# EAGLE design working (EAGLE 6.5.0)
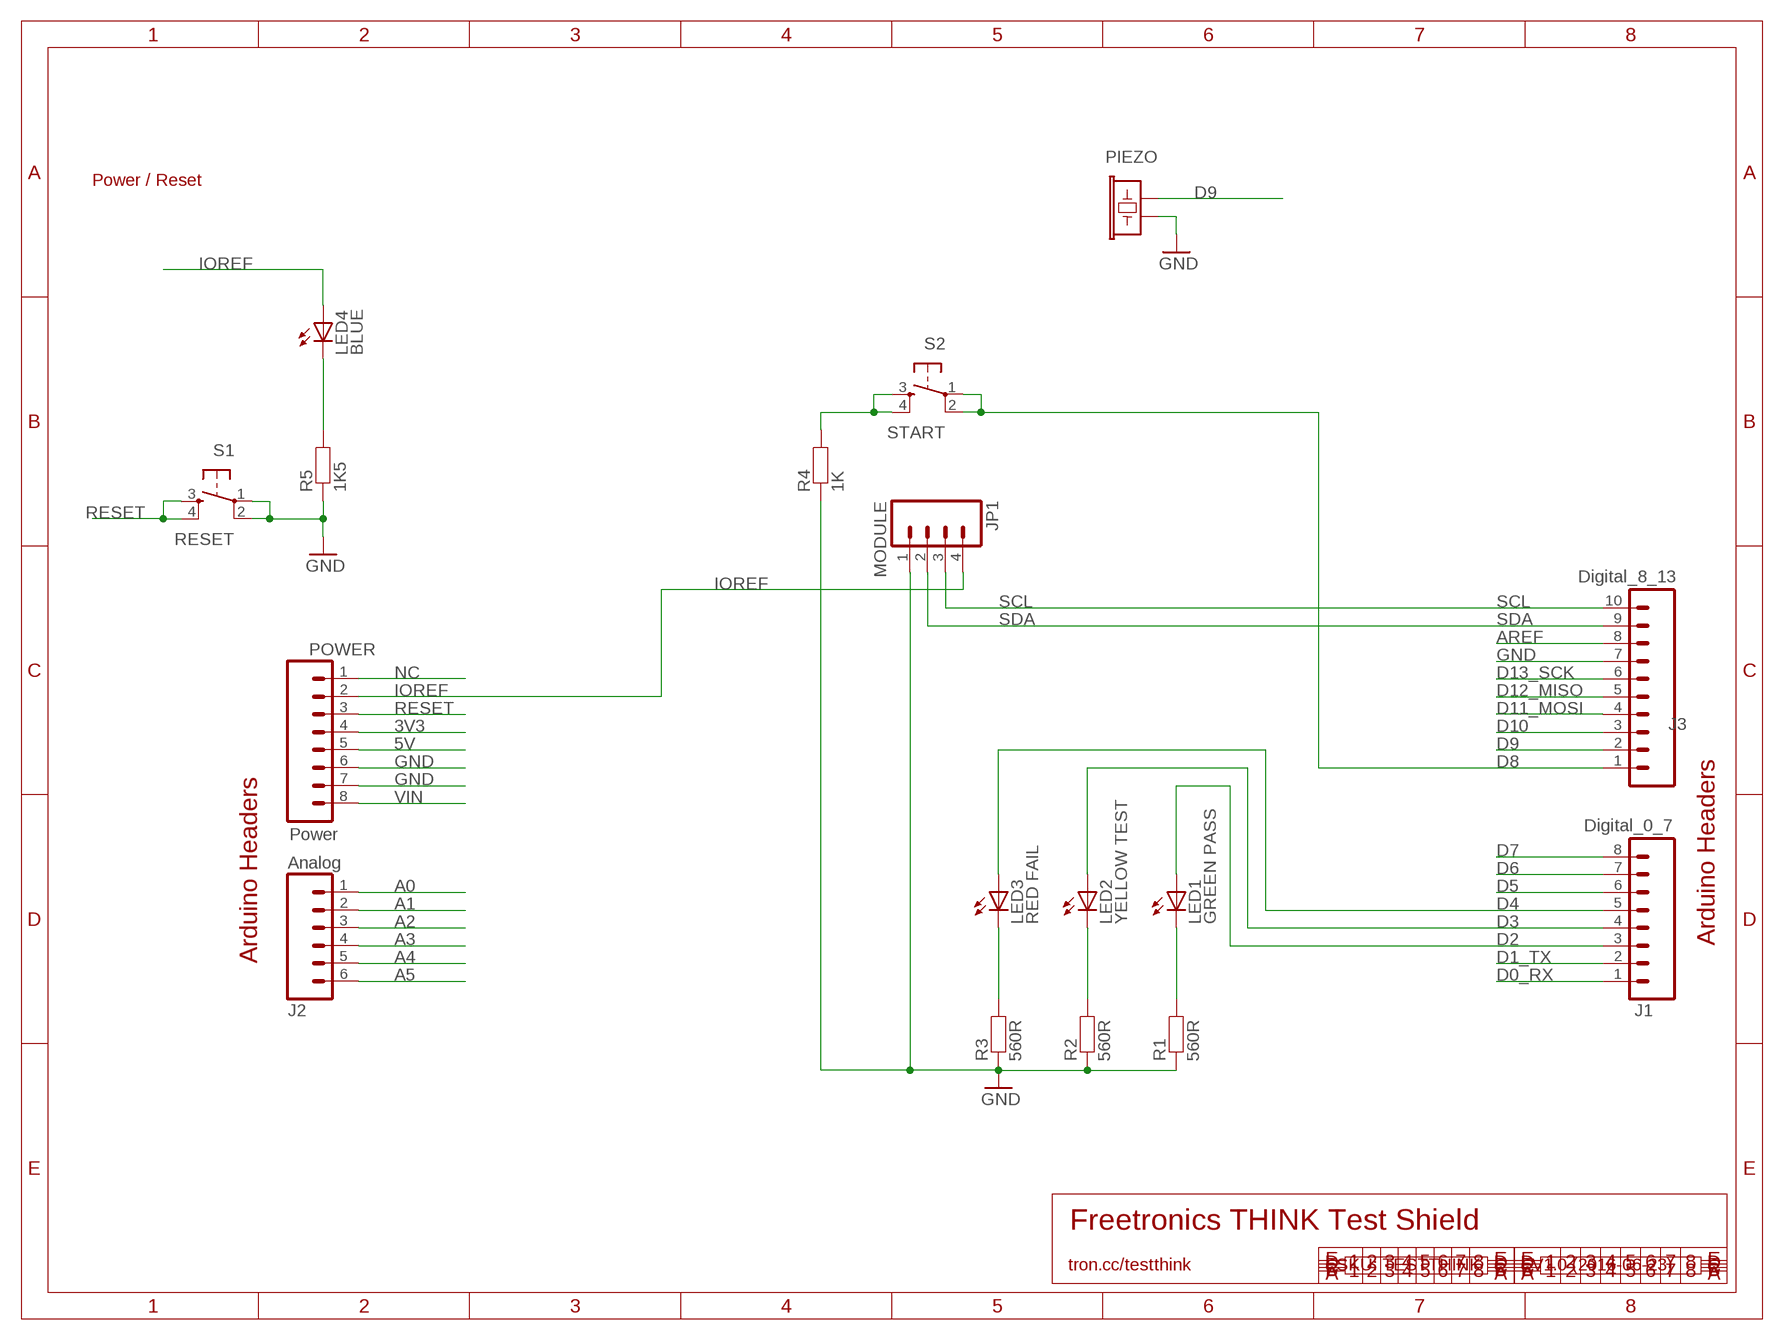
[diagram p0: schematic, sheet 1]

## Parts
J1  Digital_0_7  M08  [1X08]
J2  Analog  M06SIP  [1X06]
J3  Digital_8_13  M100.1  [1X10]
JP1  MODULE  M04PTH  [1X04]
LED1  GREEN PASS  LED0603  [LED-0603]
LED2  YELLOW TEST  LED0603  [LED-0603]
LED3  RED FAIL  LED0603  [LED-0603]
LED4  BLUE  LED0603  [LED-0603]
PIEZO  BUZZERSMD12X12  [BUZZER-12X12-SMT]
POWER  Power  M08  [1X08]
R1  560R  RESISTOR0603  [0603]
R2  560R  RESISTOR0603  [0603]
R3  560R  RESISTOR0603  [0603]
R4  1K  RESISTOR0603  [0603]
R5  1K5  RESISTOR0603  [0603]
S1  RESET  TAC_SWITCHPTH  [TACTILE-PTH]
S2  START  TAC_SWITCHPTH  [TACTILE-PTH]

## Nets
3V3: POWER.4
5V: POWER.5
A0: J2.1
A1: J2.2
A2: J2.3
A3: J2.4
A4: J2.5
A5: J2.6
AREF: J3.8
D0_RX: J1.1
D1_TX: J1.2
D2: J1.3 LED1.A
D3: J1.4 LED2.A
D4: J1.5 LED3.A
D5: J1.6
D6: J1.7
D7: J1.8
D8: J3.1 S2.1 S2.2
D9: J3.2 PIEZO.2
D10: J3.3
D11_MOSI: J3.4
D12_MISO: J3.5
D13_SCK: J3.6
GND: J3.7 JP1.1 PIEZO.1 POWER.6 POWER.7 R1.1 R2.1 R3.1 R4.1 R5.1 S1.1 S1.2
IOREF: JP1.4 LED4.A POWER.2
N$1: LED1.C R1.2
N$2: LED2.C R2.2
N$3: LED3.C R3.2
N$4: LED4.C R5.2
N$7: R4.2 S2.3 S2.4
NC: POWER.1
RESET: POWER.3 S1.3 S1.4
SCL: J3.10 JP1.3
SDA: J3.9 JP1.2
VIN: POWER.8

## Notes on the sheet
- Power / Reset
- Arduino Headers
- Arduino Headers
- Freetronics THINK Test Shield
- tron.cc/testthink | SKU: TESTTHINK | V1.0 (2016-06-23)

## Library data of the parts
J1 POWER = freetronics:M08: Header 8 Standard 8-pin 0.1" header. Use with straight break away headers (SKU : PRT-00116), right angle break away headers (PRT-00553), swiss pins (PRT-00743), machine pins (PRT-00117), and female headers (PRT-00115).
J2 = freetronics:M06: Header 6 Standard 6-pin 0.1" header. Use with straight break away headers (SKU : PRT-00116), right angle break away headers (PRT-00553), swiss pins (PRT-00743), machine pins (PRT-00117), and female headers (PRT-00115). Molex polarized connector foot print use with SKU : PRT-08094 with associated crimp pins and housings. NOTES ON THE VARIANTS LOCK and LOCK_LONGPADS... This footprint was designed to help hold the alignment of a through-hole component (i.e. 6-pin header) while soldering it into place. You may notice that each hole has been shifted either up or down by 0.005 of an inch from it's more standard position (which is a perfectly straight line). This slight alteration caused the pins (the squares in the middle) to touch the edges of the holes. Because they are alternating, it causes a "brace" to hold the component in place. 0.005 has proven to be the perfect amount of "off-center" position when using our standard breakaway headers. Although looks a little odd when you look at the bare footprint, once you have a header in there, the alteration is very hard to notice. Also, if you push a header all the way into place, it is covered up entirely on the bottom side. This idea of altering the position of holes to aid alignment will be further integrated into the Sparkfun Library for other footprints. It can help hold any component with 3 or more connection pins.
J3 = freetronics-original:M10: Header 10 Standard 10-pin 0.1" header. Use with straight break away headers (SKU : PRT-00116), right angle break away headers (PRT-00553), swiss pins (PRT-00743), machine pins (PRT-00117), and female headers (PRT-00115).
JP1 = freetronics-master-v1.1:M04: Header 4 Standard 4-pin 0.1" header. Use with straight break away headers (SKU : PRT-00116), right angle break away headers (PRT-00553), swiss pins (PRT-00743), machine pins (PRT-00117), and female headers (PRT-00115). Molex polarized connector foot print use with SKU : PRT-08231 with associated crimp pins and housings.
LED1-LED4 = freetronics-jon:LED: LEDs Standard schematic elements and footprints for 5mm, 3mm, 1206, and 0603 sized LEDs. 5mm - Spark Fun Electronics SKU : COM-00529 (and others)
PIEZO = freetronics-master-v1:BUZZER: Buzzer - Piezo Transducer
R1-R5 = freetronics-jon:RESISTOR: Resistor Basic schematic elements and footprints for 0603, 1206, and PTH 1/10th watt (small) resistors.
S1 S2 = freetronics:TAC_SWITCH: Momentary Switch Button commonly used for reset or general input. Spark Fun Electronics SKU : COM-00097

## Board
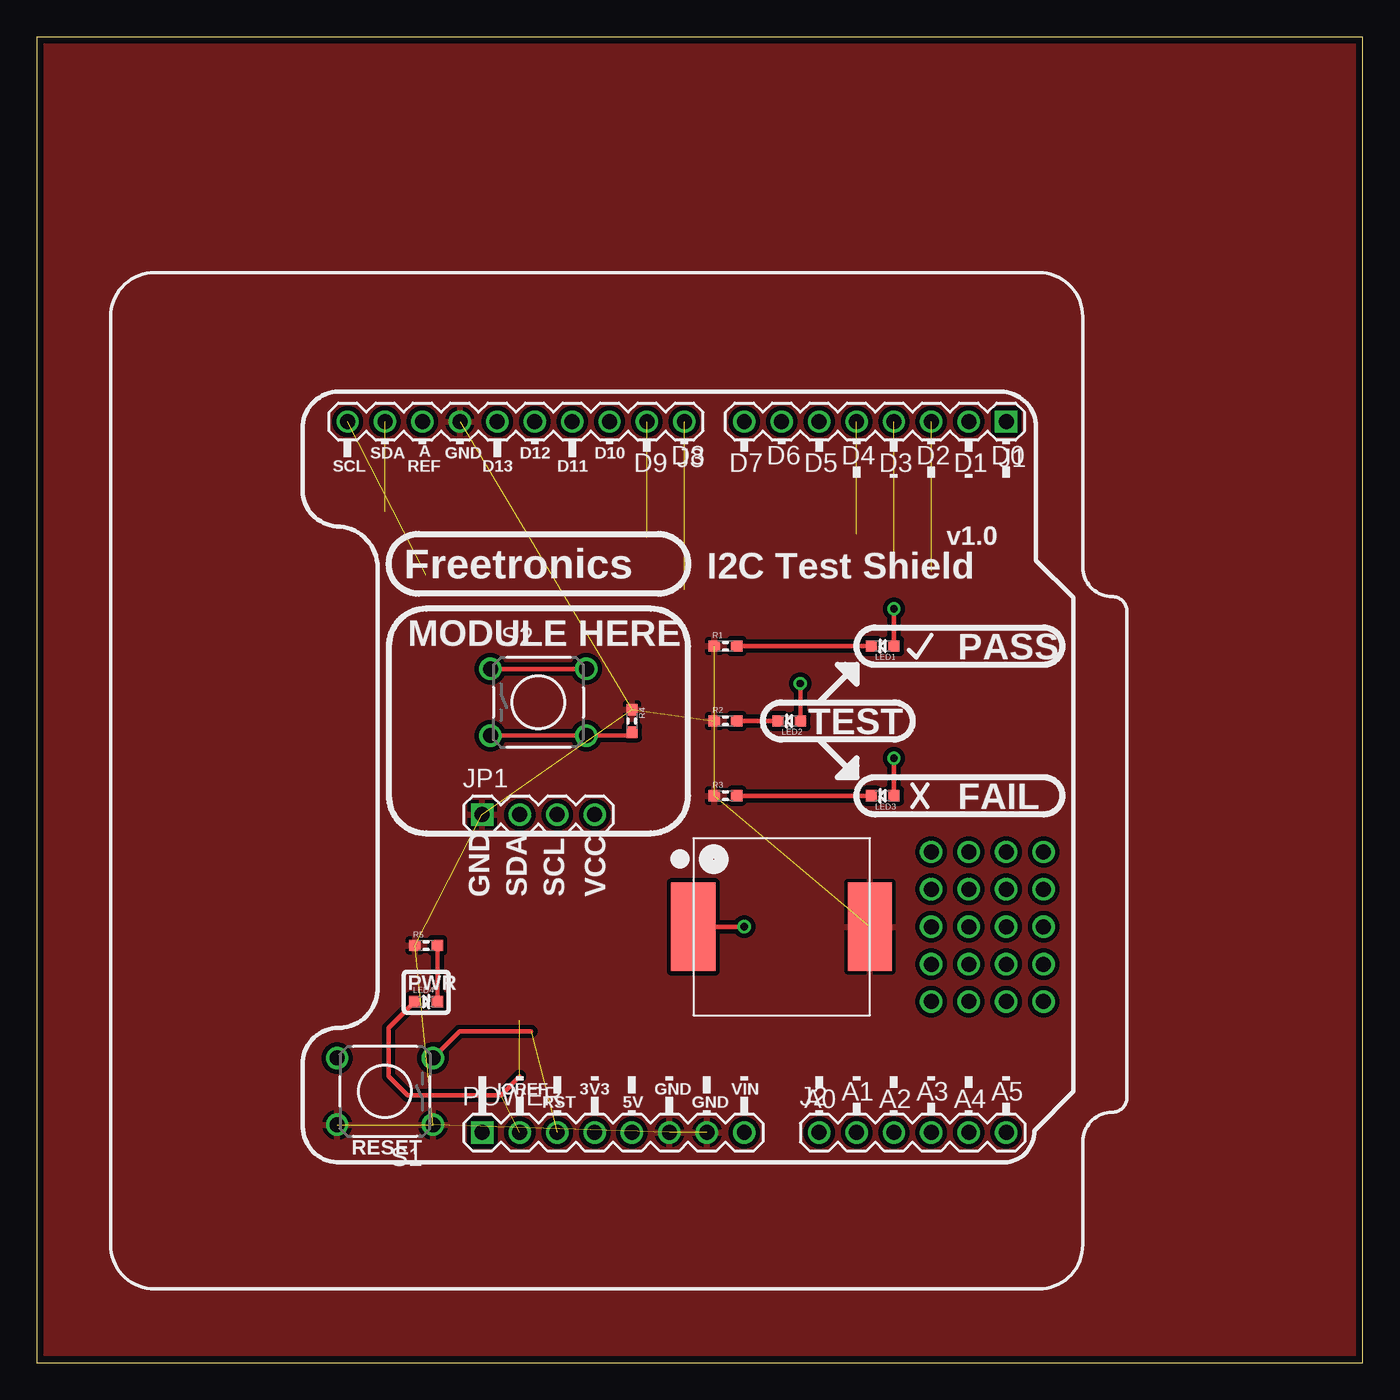
[diagram p1: board, top side]
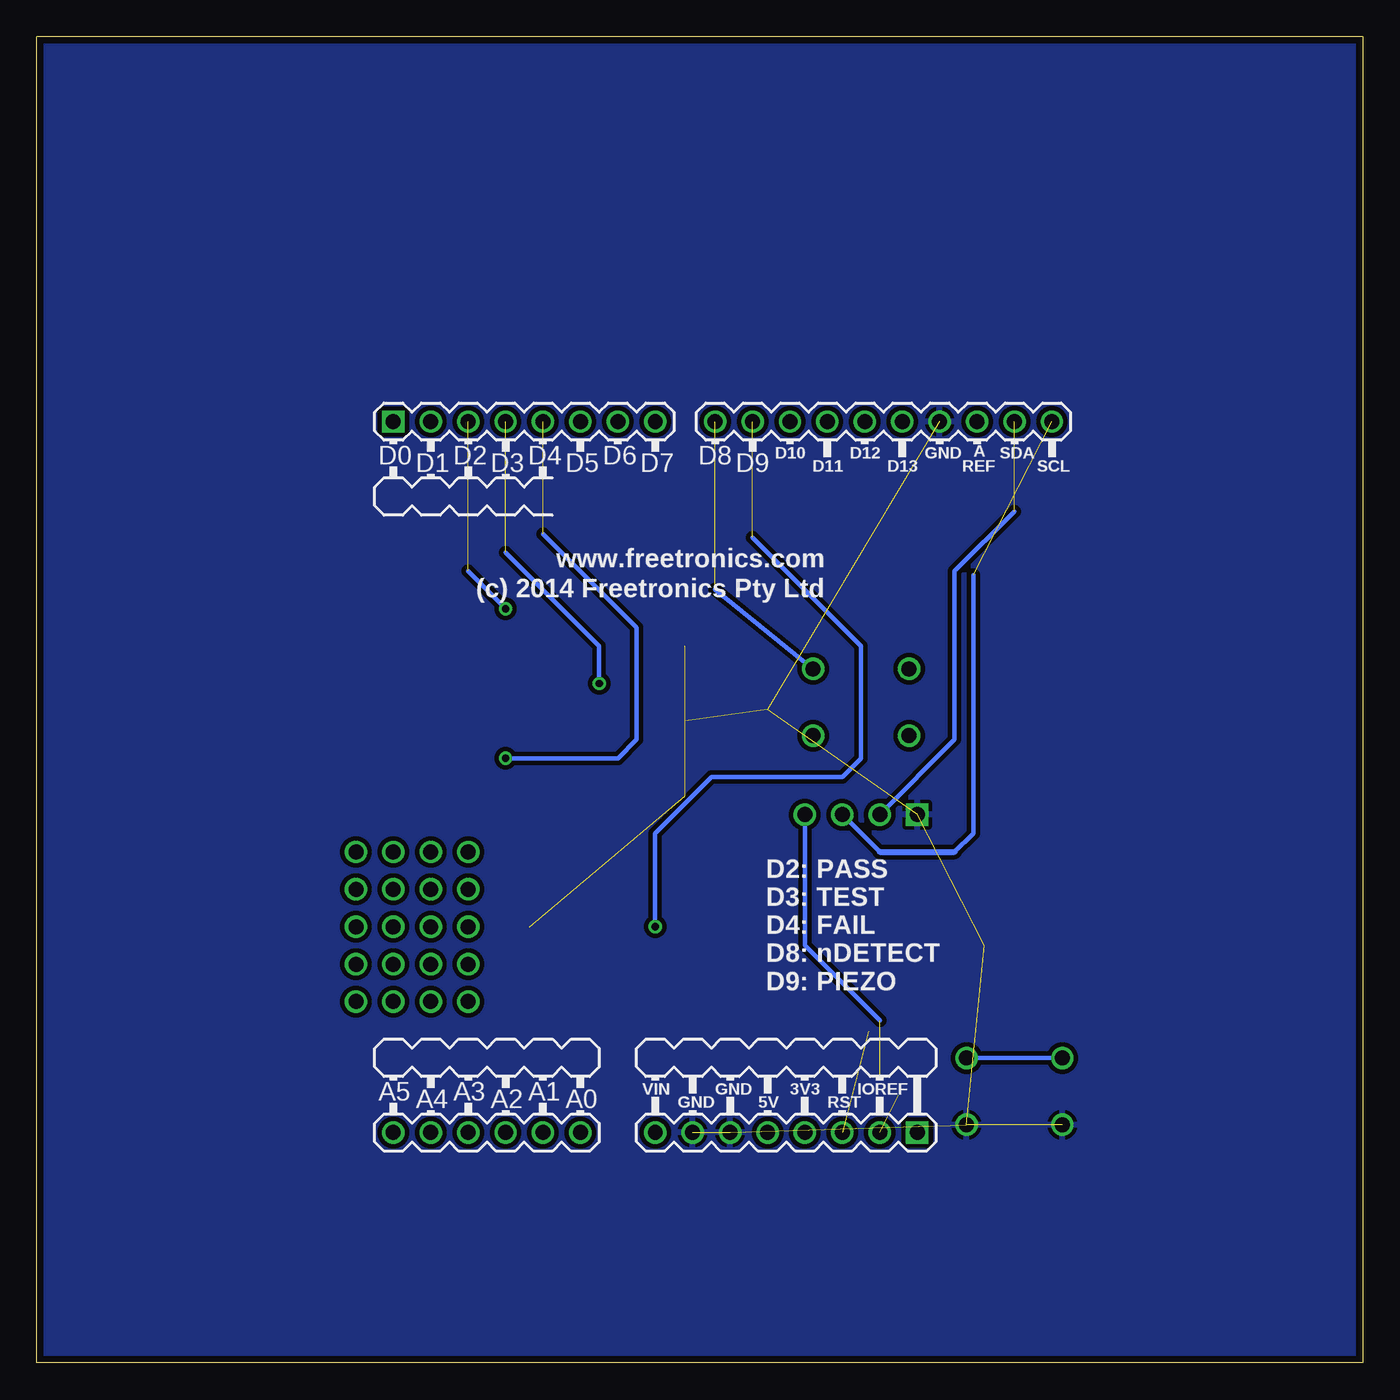
[diagram p2: board, bottom side, seen from below]

Size 90 x 90 mm. Coordinates in mm from the lower left corner, seen from the top.
Outline: 0,0 90,0 90,90 0,90 0,0
Copper layers (1*16): Top 0.035mm / dielectric 1.5mm / Bottom 0.035mm
Design rules "default *": minimum track width 10mil, minimum drill 24mil, track to track 12mil, track to pad 12mil, pad to pad 12mil, via to via 12mil, smd to smd 8mil, copper to edge 18mil, drill to drill 8mil, minimum pad ring 10mil, minimum via ring 8mil, stop-mask expansion 4mil, vias tented up to drill 0mil, thermal gap 10mil

### Footprints (pad centres in the part's own frame; a part is rotated, then mirrored left to right if it is on the bottom)
1X08 = drill 1.016 square: 1 0,0 | drill 1.016: 2 2.54,0; 3 5.08,0; 4 7.62,0; 5 10.16,0; 6 12.7,0; 7 15.24,0; 8 17.78,0
1X06 = drill 1.016: 1 0,0; 2 2.54,0; 3 5.08,0; 4 7.62,0; 5 10.16,0; 6 12.7,0
1X10 = drill 1.016: 1 0,0; 2 2.54,0; 3 5.08,0; 4 7.62,0; 5 10.16,0; 6 12.7,0; 7 15.24,0; 8 17.78,0; 9 20.32,0; 10 22.86,0
1X04 = drill 1.016 square: 1 0,0 | drill 1.016: 2 2.54,0; 3 5.08,0; 4 7.62,0
LED-0603 = smd 0.762 x 0.762: A -0.762,0; C 0.762,0
BUZZER-12X12-SMT = smd 3 x 6: 1 -6,0; 2 6,0
0603 = smd 0.762 x 0.762: 1 -0.762,0; 2 0.762,0
TACTILE-PTH = drill 1.016: 1 -3.251,2.261; 2 3.251,2.261; 3 -3.251,-2.261; 4 3.251,-2.261

### Placement (x,y rotation side)
J1  65.8,63.88 180 top
J2  53.1,15.62 0 top
J3  43.96,63.88 180 top
JP1  30.24,37.21 0 top
LED1  57.42,48.64 180 top
LED2  51.07,43.56 180 top
LED3  57.42,38.48 180 top
LED4  26.43,24.51 0 top
PIEZO  50.56,29.59 180 top
POWER  30.24,15.62 0 top
R1  46.75,48.64 0 top
R2  46.75,43.56 0 top
R3  46.75,38.48 0 top
R4  40.4,43.56 270 top
R5  26.43,28.32 0 top
S1  23.64,18.41 180 top
S2  34.05,44.83 0 top

### Tracks (layer width: path | path; a pad name or v marks a point on that pad's centre or on a via)
D2  (via drill 0.5)  (1 unrouted)
  Top 0.305: LED1.A v58.18,51.18
  Bottom 0.305: v58.18,51.18 60.72,53.72
D3  (via drill 0.5)  (1 unrouted)
  Top 0.305: LED2.A v51.83,46.1
  Bottom 0.305: v51.83,46.1 51.83,48.64 58.18,54.99
D4  (via drill 0.5)  (1 unrouted)
  Top 0.305: LED3.A v58.18,41.02
  Bottom 0.305: v58.18,41.02 50.56,41.02 49.29,42.29 49.29,49.91 55.64,56.26
D8  (1 unrouted)
  Top 0.305: S2.2 S2.1
  Bottom 0.305: S2.2 43.96,52.48
D9  (via drill 0.5)  (1 unrouted)
  Top 0.305: PIEZO.2 v48.02,29.59
  Bottom 0.305: v48.02,29.59 48.02,35.94 44.21,39.75 35.32,39.75 34.05,41.02 34.05,48.64 41.42,56.01
GND  (11 unrouted)
  pour Bottom: 90,90 90,0 0,0 0,90
  pour Top: 0,90 90,90 90,0 0,0
IOREF  (2 unrouted)
  Top 0.305: LED4.A 23.89,22.73 23.89,19.43 25.16,18.16 31.51,18.16 32.78,19.43
  Bottom 0.305: 32.78,23.24 37.86,28.32 JP1.4
N$1
  Top 0.305: R1.2 LED1.C
N$2
  Top 0.305: R2.2 LED2.C
N$3
  Top 0.305: R3.2 LED3.C
N$4
  Top 0.305: R5.2 LED4.C
N$7
  Top 0.305: R4.2 40.17,42.57 S2.4 S2.3
N$11  (via drill 1.02)
  other vias: 60.72,34.67
N$12  (via drill 1.02)
  other vias: 63.26,34.67
N$13  (via drill 1.02)
  other vias: 65.8,34.67
N$14  (via drill 1.02)
  other vias: 68.34,34.67
N$15  (via drill 1.02)
  other vias: 68.34,32.13
N$16  (via drill 1.02)
  other vias: 65.8,32.13
N$17  (via drill 1.02)
  other vias: 63.26,32.13
N$18  (via drill 1.02)
  other vias: 60.72,32.13
N$29  (via drill 1.02)
  other vias: 60.72,29.59
N$30  (via drill 1.02)
  other vias: 63.26,29.59
N$31  (via drill 1.02)
  other vias: 65.8,29.59
N$32  (via drill 1.02)
  other vias: 68.34,29.59
N$33  (via drill 1.02)
  other vias: 68.34,27.05
N$34  (via drill 1.02)
  other vias: 65.8,27.05
N$35  (via drill 1.02)
  other vias: 63.26,27.05
N$36  (via drill 1.02)
  other vias: 60.72,27.05
N$46  (via drill 1.02)
  other vias: 68.34,24.51
N$47  (via drill 1.02)
  other vias: 65.8,24.51
N$48  (via drill 1.02)
  other vias: 63.26,24.51
N$49  (via drill 1.02)
  other vias: 60.72,24.51
RESET  (1 unrouted)
  Top 0.305: 33.54,22.48 28.69,22.48 S1.3
  Bottom 0.305: S1.4 S1.3
  Bottom 0.61: S1.3 26.91,20.68
SCL  (1 unrouted)
  Bottom 0.305: JP1.3 32.78,34.67 | 27.7,34.67 26.43,35.94 26.43,53.47
  Bottom 0.406: 32.78,34.67 27.7,34.67
SDA  (1 unrouted)
  Bottom 0.305: 23.64,57.78 27.7,53.72 27.7,42.29 JP1.2

### Text on the board
tPlace: SDA | A | GND | D12 | D10 | D8 | D6 | D4 | D2 | D0 | SCL | REF | D13 | D11 | D9 | D7 | D5 | D3 | D1 | v1.0 | Freetronics | I2C Test Shield | MODULE HERE | PASS | TEST | FAIL | GND | SDA | SCL | VCC | PWR | IOREF | 3V3 | GND | VIN | A1 | A3 | A5 | RST | 5V | GND | A0 | A2 | A4 | RESET
bPlace: SDA | A | GND | D12 | D10 | D8 | D6 | D4 | D2 | D0 | SCL | REF | D13 | D11 | D9 | D7 | D5 | D3 | D1 | www.freetronics.com | (c) 2014 Freetronics Pty Ltd | D2: PASS / D3: TEST / D4: FAIL / D8: nDETECT / D9: PIEZO | IOREF | 3V3 | GND | VIN | A1 | A3 | A5 | RST | 5V | GND | A0 | A2 | A4
tDocu: K | A | K | A | K | A